# Altium schematic sheet Master.SchDoc: QUTMS Shutdown Board V2.1 - Master Top
size A4; DocumentNumber: 1; Revision: 4; SheetNumber: 1; SheetTotal: 4
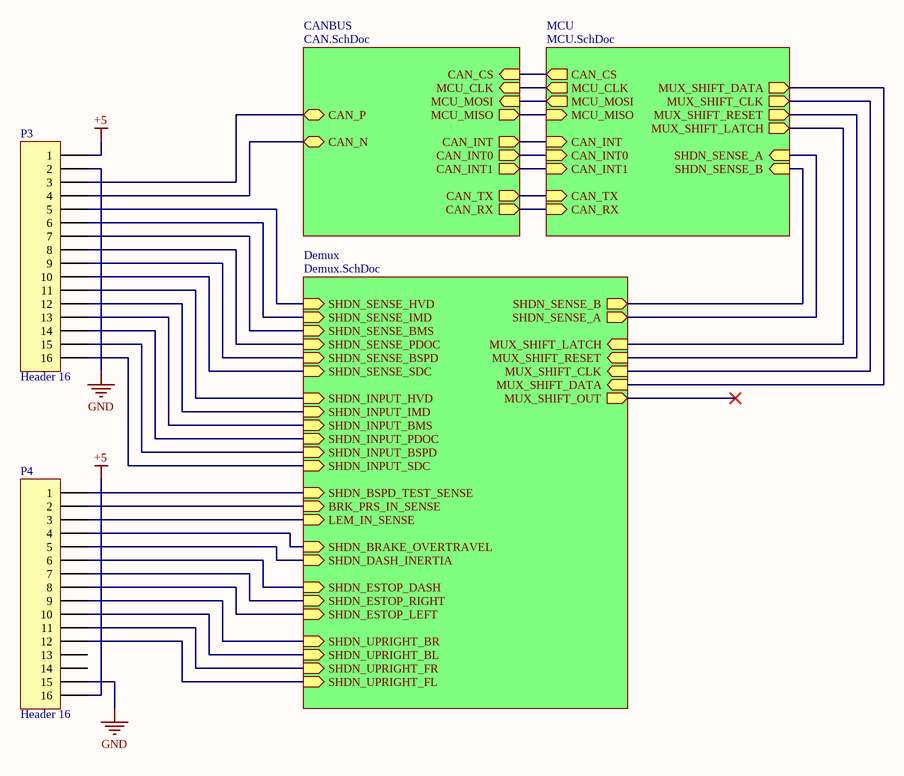
[diagram p0: Master.SchDoc]

## Parts
P3  Header 16  [HDR1X16]
P4  Header 16  [HDR1X16]

## Sub-sheets
CANBUS = CAN.SchDoc: MCU_MOSI (in), MCU_CLK (in), CAN_CS (in), MCU_MISO (out), CAN_N (bidir), CAN_P (bidir), CAN_INT1 (out), CAN_INT0 (out), CAN_INT (out), CAN_TX (out), CAN_RX (out)
Demux = Demux.SchDoc: SHDN_ESTOP_DASH (in), SHDN_UPRIGHT_BL (in), SHDN_UPRIGHT_BR (in), SHDN_ESTOP_LEFT (in), SHDN_ESTOP_RIGHT (in), SHDN_DASH_INERTIA (in), SHDN_UPRIGHT_FR (in), SHDN_UPRIGHT_FL (in), SHDN_BRAKE_OVERTRAVEL (in), SHDN_BSPD_TEST_SENSE (in), BRK_PRS_IN_SENSE (in), LEM_IN_SENSE (in), SHDN_INPUT_HVD (in), SHDN_INPUT_IMD (in), SHDN_INPUT_BMS (in), SHDN_INPUT_PDOC (in), SHDN_INPUT_BSPD (in), SHDN_SENSE_HVD (in), SHDN_SENSE_IMD (in), SHDN_SENSE_BMS (in), SHDN_SENSE_PDOC (in), SHDN_SENSE_BSPD (in), SHDN_SENSE_A (out), MUX_SHIFT_OUT (out), SHDN_SENSE_B (out), MUX_SHIFT_LATCH (in), MUX_SHIFT_RESET (in), MUX_SHIFT_CLK (in), MUX_SHIFT_DATA (in), SHDN_INPUT_SDC (in), SHDN_SENSE_SDC (in)
MCU = MCU.SchDoc: MCU_MISO (in), MCU_MOSI (out), CAN_CS (out), MCU_CLK (out), CAN_INT (in), CAN_INT0 (in), CAN_INT1 (in), SHDN_SENSE_B (in), SHDN_SENSE_A (in), MUX_SHIFT_LATCH (out), MUX_SHIFT_RESET (out), MUX_SHIFT_CLK (out), MUX_SHIFT_DATA (out), CAN_RX (in), CAN_TX (in)

## Nets
+5: P3.1 P4.16
GND: P3.2 P4.15
NetP3_3: P3.3 ; sheet CANBUS/CAN_P
NetP3_4: P3.4 ; sheet CANBUS/CAN_N
NetP3_5: P3.5 ; sheet Demux/SHDN_SENSE_HVD
NetP3_6: P3.6 ; sheet Demux/SHDN_SENSE_IMD
NetP3_7: P3.7 ; sheet Demux/SHDN_SENSE_BMS
NetP3_8: P3.8 ; sheet Demux/SHDN_SENSE_PDOC
NetP3_9: P3.9 ; sheet Demux/SHDN_SENSE_BSPD
NetP3_10: P3.10 ; sheet Demux/SHDN_SENSE_SDC
NetP3_11: P3.11 ; sheet Demux/SHDN_INPUT_HVD
NetP3_12: P3.12 ; sheet Demux/SHDN_INPUT_IMD
NetP3_13: P3.13 ; sheet Demux/SHDN_INPUT_BMS
NetP3_14: P3.14 ; sheet Demux/SHDN_INPUT_PDOC
NetP3_15: P3.15 ; sheet Demux/SHDN_INPUT_BSPD
NetP3_16: P3.16 ; sheet Demux/SHDN_INPUT_SDC
NetP4_1: P4.1 ; sheet Demux/SHDN_BSPD_TEST_SENSE
NetP4_2: P4.2 ; sheet Demux/BRK_PRS_IN_SENSE
NetP4_3: P4.3 ; sheet Demux/LEM_IN_SENSE
NetP4_4: P4.4 ; sheet Demux/SHDN_BRAKE_OVERTRAVEL
NetP4_5: P4.5 ; sheet Demux/SHDN_DASH_INERTIA
NetP4_6: P4.6 ; sheet Demux/SHDN_ESTOP_DASH
NetP4_7: P4.7 ; sheet Demux/SHDN_ESTOP_RIGHT
NetP4_8: P4.8 ; sheet Demux/SHDN_ESTOP_LEFT
NetP4_9: P4.9 ; sheet Demux/SHDN_UPRIGHT_BR
NetP4_10: P4.10 ; sheet Demux/SHDN_UPRIGHT_BL
NetP4_11: P4.11 ; sheet Demux/SHDN_UPRIGHT_FR
NetP4_12: P4.12 ; sheet Demux/SHDN_UPRIGHT_FL
(unnamed): sheet MCU/MCU_MISO, sheet CANBUS/MCU_MISO
(unnamed): sheet MCU/MCU_MOSI, sheet CANBUS/MCU_MOSI
(unnamed): sheet MCU/CAN_CS, sheet CANBUS/CAN_CS
(unnamed): sheet MCU/MCU_CLK, sheet CANBUS/MCU_CLK
(unnamed): sheet MCU/CAN_INT, sheet CANBUS/CAN_INT
(unnamed): sheet MCU/CAN_INT0, sheet CANBUS/CAN_INT0
(unnamed): sheet MCU/CAN_INT1, sheet CANBUS/CAN_INT1
(unnamed): sheet MCU/SHDN_SENSE_B, sheet Demux/SHDN_SENSE_B
(unnamed): sheet MCU/SHDN_SENSE_A, sheet Demux/SHDN_SENSE_A
(unnamed): sheet MCU/MUX_SHIFT_LATCH, sheet Demux/MUX_SHIFT_LATCH
(unnamed): sheet MCU/MUX_SHIFT_RESET, sheet Demux/MUX_SHIFT_RESET
(unnamed): sheet MCU/MUX_SHIFT_CLK, sheet Demux/MUX_SHIFT_CLK
(unnamed): sheet MCU/MUX_SHIFT_DATA, sheet Demux/MUX_SHIFT_DATA
(unnamed): sheet MCU/CAN_RX, sheet CANBUS/CAN_RX
(unnamed): sheet MCU/CAN_TX, sheet CANBUS/CAN_TX

Not connected (* = marked no-connect by the designer): P4 13 14

## Notes on the sheet
- Title
- Size:
- A4
- Number:
- Revision:
- QUT Motorsport, O-120
- O Block, QUT Gardens Point
- Date:
- Time:
- Sheet
- of
- Brisbane, QLD, Australia

## Library data of the parts
P3 P4 = Header 16: Header, 16-Pin; LatestRevisionDate: 17-Jul-2002; LatestRevisionNote: Re-released for DXP Platform.; Publisher: Altium Limited